# Altium schematic sheet Block.SchDoc: Ararinha 6F
size A4; Revision: 2.0; SheetNumber: 1; SheetTotal: 7
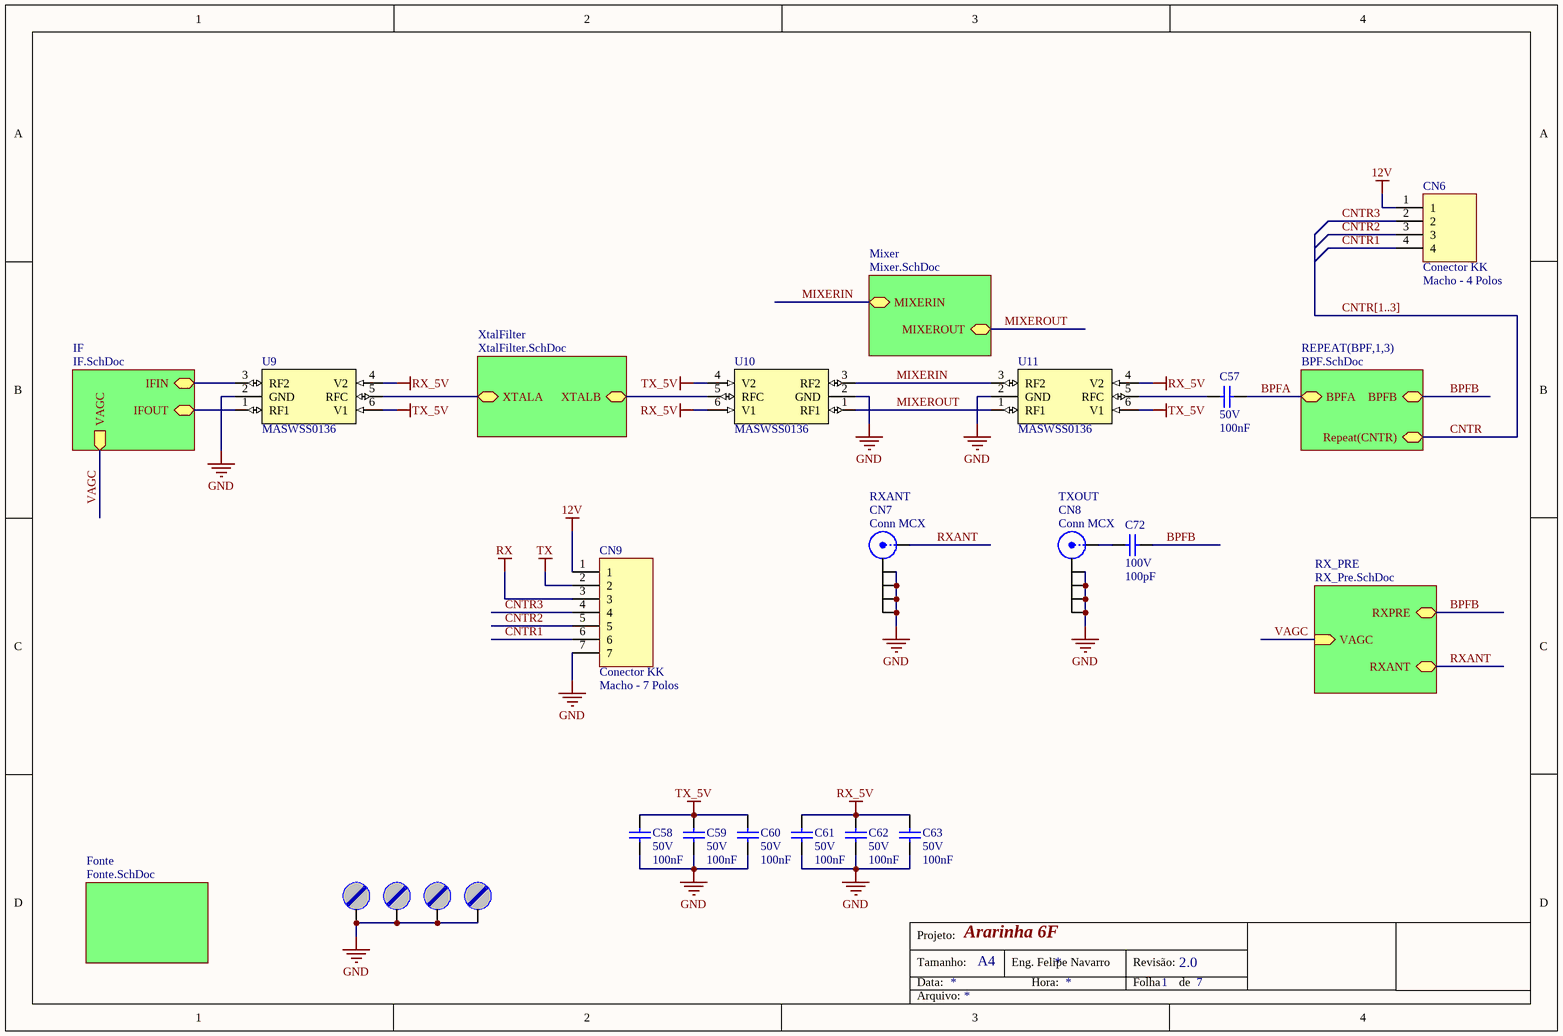
[diagram p0: Block.SchDoc]

## Parts
C57  value 100nF  Tensão: 50V  [CC0603]  (hidden comment: Capacitor Cerâmico)
C58  value 100nF  Tensão: 50V  [CC0603]  (hidden comment: Capacitor Cerâmico)
C59  value 100nF  Tensão: 50V  [CC0603]  (hidden comment: Capacitor Cerâmico)
C60  value 100nF  Tensão: 50V  [CC0603]  (hidden comment: Capacitor Cerâmico)
C61  value 100nF  Tensão: 50V  [CC0603]  (hidden comment: Capacitor Cerâmico)
C62  value 100nF  Tensão: 50V  [CC0603]  (hidden comment: Capacitor Cerâmico)
C63  value 100nF  Tensão: 50V  [CC0603]  (hidden comment: Capacitor Cerâmico)
C72  value 100pF  Tensão: 100V  [CC0603]  (hidden comment: Capacitor Cerâmico)
CN6  Conector KK  value Macho - 4 Polos  [CONN HDR4-POL P.100]
CN7  Conn MCX  [CONN MCX MOLEX]
CN8  Conn MCX  [CONN MCX MOLEX]
CN9  Conector KK  value Macho - 7 Polos  [CONN HDR7-POL P.100]
HOLE1  Furo de Fixação  [Furo_M3]  (value not drawn)  (no BOM)
HOLE2  Furo de Fixação  [Furo_M3]  (value not drawn)  (no BOM)
HOLE3  Furo de Fixação  [Furo_M3]  (value not drawn)  (no BOM)
HOLE4  Furo de Fixação  [Furo_M3]  (value not drawn)  (no BOM)
U9  MASWSS0136  [SC70-6N]
U10  MASWSS0136  [SC70-6N]
U11  MASWSS0136  [SC70-6N]

## Sub-sheets
Fonte = Fonte.SchDoc: no entries
IF = IF.SchDoc: IFIN (bidir), IFOUT (bidir), VAGC (out)
Mixer = Mixer.SchDoc: MIXERIN (bidir), MIXEROUT (bidir)
REPEAT(BPF,1,3) = BPF.SchDoc: BPFA, BPFB, Repeat(CNTR)
RX_PRE = RX_Pre.SchDoc: VAGC (in), RXPRE (bidir), RXANT (bidir)
XtalFilter = XtalFilter.SchDoc: XTALB (bidir), XTALA (bidir)

## Nets
12V: CN6.1 CN9.1
GND: C58.1 C59.1 C60.1 C61.1 C62.1 C63.1 CN7.2(Y) CN7.3(Y) CN7.4(Y) CN7.5(Y) CN8.2(Y) CN8.3(Y) CN8.4(Y) CN8.5(Y) CN9.7 HOLE1.X HOLE2.X HOLE3.X HOLE4.X U9.2(GND) U10.2(GND) U11.2(GND)
RX: CN9.3
RX_5V: C61.2 C62.2 C63.2 U9.4(V2) U10.6(V1) U11.4(V2)
TX: CN9.2
TX_5V: C58.2 C59.2 C60.2 U9.6(V1) U10.4(V2) U11.6(V1)
BPFA: C57.2 ; sheet REPEAT(BPF,1,3)/BPFA
BPFB: C72.2 ; sheet REPEAT(BPF,1,3)/BPFB, sheet RX_PRE/RXPRE
CNTR: sheet REPEAT(BPF,1,3)/Repeat(CNTR)
CNTR1: CN6.4 CN9.6
CNTR2: CN6.3 CN9.5
CNTR3: CN6.2 CN9.4
MIXERIN: U10.3(RF2) U11.3(RF2) ; sheet Mixer/MIXERIN
MIXEROUT: U10.1(RF1) U11.1(RF1) ; sheet Mixer/MIXEROUT
RXANT: CN7.1(X) ; sheet RX_PRE/RXANT
VAGC: sheet IF/VAGC, sheet RX_PRE/VAGC
NetC57_1: C57.1 U11.5(RFC)
NetC72_1: C72.1 CN8.1(X)
NetU9_1: U9.1(RF1) ; sheet IF/IFOUT
NetU9_3: U9.3(RF2) ; sheet IF/IFIN
NetU9_5: U9.5(RFC) ; sheet XtalFilter/XTALA
NetU10_5: U10.5(RFC) ; sheet XtalFilter/XTALB

## Buses and harness runs
bus CNTR[1..3]

## Notes on the sheet
- (near CN7) RXANT
- TXOUT
- Projeto:
- Tamanho:
- Data:
- A4
- Eng. Felipe Navarro
- Hora:
- Revisão:
- Folha
- de
- Arquivo:

## Library data of the parts
C57-C63 = Cap 100nF 50V 0603 X7R: Capacitor (Semiconductor SIM Model); Chinês: Local; ChinesePrice: 0,00250; Corrente: *A; Potência: *W; Obs:: X7R; Tolerância: ±10%; Supplier 1: Digi-Key; Supplier Part Number 1: 1276-1000-1-ND; ComponentLink1Description: Datasheet; ComponentLink1URL: D:\Tecnoclade\Datasheet\!DataMissing.pdf
C72 = Cap 100pF 100V 0603 NP0: Capacitor (Semiconductor SIM Model); Chinês: -----; ChinesePrice: 0,00000; Corrente: *A; Potência: *W; Obs:: NP0; Tolerância: ±5%; Supplier 1: Digi-Key; Supplier Part Number 1: 1276-1295-1-ND; ComponentLink1Description: Datasheet; ComponentLink1URL: D:\Tecnoclade\Datasheet\!DataMissing.pdf
CN6 = KK 4P Macho-V P2.54mm: ChinesePrice: 0,00000; Chinês: ----; Corrente: *; Potência: *; Supplier 1: Digi-Key; Supplier Part Number 1: A19431-ND; Tensão: *; Obs:: *; Tolerância: *; ComponentLink1Description: Datasheet; ComponentLink1URL: D:\Tecnoclade\Datasheet\!DataMissing.pdf
CN7 CN8 = Conn MCX: Conector MCX; ChinesePrice: 0,00000; Chinês: ----; Value: SMA; Corrente: *; Potência: *; Supplier 1: Digi-Key; Supplier Part Number 1: WM5541-ND; Tensão: *; Obs:: *; Tolerância: *; ComponentLink1Description: Datasheet; ComponentLink1URL: D:\Tecnoclade\Datasheet\!DataMissing.pdf
CN9 = KK 7P Macho-V P2.54mm: ChinesePrice: 0,00000; Chinês: ----; Corrente: *; Potência: *; Supplier 1: Digi-Key; Supplier Part Number 1: A19472-ND; Tensão: *; Obs:: *; Tolerância: *; ComponentLink1Description: Datasheet; ComponentLink1URL: D:\Tecnoclade\Datasheet\!DataMissing.pdf
HOLE1-HOLE4 = Parafuso: Furo para parafuso; Value: M3; ChinesePrice: 0,00000; Chinês: ----; Corrente: *; Potência: *; Supplier 1: Digi-Key; Supplier Part Number 1: --Del; Tensão: *; Obs:: *; Tolerância: *; ComponentLink1Description: Datasheet; ComponentLink1URL: D:\Tecnoclade\Datasheet\!DataMissing.pdf
U9-U11 = MASWSS0136: GaAs SPDT Switch DC - 3.0 GHz; ChinesePrice: 1,94000; Chinês: Local; Value: Memória; Corrente: *; Potência: *; Supplier 1: Digi-Key; Supplier Part Number 1: 1465-1376-1-ND; Tensão: *; Obs:: *; Tolerância: *; ComponentLink1Description: Datasheet; ComponentLink1URL: D:\Tecnoclade\Datasheet\!DataMissing.pdf